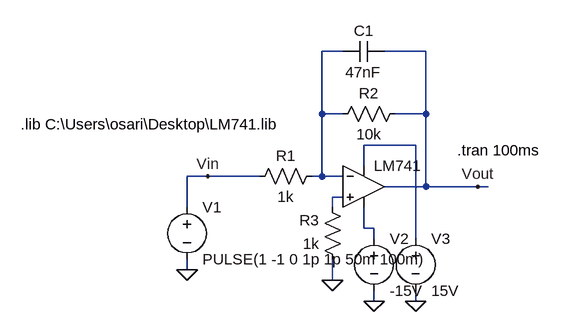
[diagram p0: schematic devre2.asc]
devre2.asc, the LTspice schematic file:
Version 4
SHEET 1 880 680
WIRE 96 0 64 0
WIRE 224 0 160 0
WIRE 64 96 64 0
WIRE 96 96 64 96
WIRE 224 96 224 0
WIRE 224 96 176 96
WIRE 208 144 128 144
WIRE 128 176 128 144
WIRE -112 192 -144 192
WIRE -32 192 -112 192
WIRE 64 192 64 96
WIRE 64 192 48 192
WIRE 96 192 64 192
WIRE 224 208 224 96
WIRE 224 208 160 208
WIRE 304 208 224 208
WIRE 320 208 304 208
WIRE 96 224 80 224
WIRE -144 240 -144 192
WIRE 80 240 80 224
WIRE 128 272 128 240
WIRE 144 272 128 272
WIRE 144 288 144 272
WIRE 208 288 208 144
WIRE -144 336 -144 320
WIRE 80 352 80 320
WIRE 144 384 144 368
WIRE 208 384 208 368
FLAG 144 384 0
FLAG 208 384 0
FLAG 304 208 Vout
FLAG -144 336 0
FLAG 80 352 0
FLAG -112 192 Vin
SYMBOL voltage -144 224 R0
WINDOW 123 0 0 Left 0
WINDOW 39 0 0 Left 0
SYMATTR InstName V1
SYMATTR Value PULSE(1 -1 0 1p 1p 50m 100m)
SYMBOL res 64 176 R90
WINDOW 0 0 56 VBottom 2
WINDOW 3 32 56 VTop 2
SYMATTR InstName R1
SYMATTR Value 1k
SYMBOL res 192 80 R90
WINDOW 0 0 56 VBottom 2
WINDOW 3 32 56 VTop 2
SYMATTR InstName R2
SYMATTR Value 10k
SYMBOL voltage 144 272 R0
WINDOW 123 0 0 Left 0
WINDOW 39 0 0 Left 0
SYMATTR InstName V2
SYMATTR Value -15V
SYMBOL voltage 208 272 R0
WINDOW 123 0 0 Left 0
WINDOW 39 0 0 Left 0
SYMATTR InstName V3
SYMATTR Value 15V
SYMBOL OpAmps\\UniversalOpamp2 128 208 R0
SYMATTR InstName LM741
SYMBOL res 96 336 R180
WINDOW 0 36 76 Left 2
WINDOW 3 36 40 Left 2
SYMATTR InstName R3
SYMATTR Value 1k
SYMBOL cap 160 -16 R90
WINDOW 0 0 32 VBottom 2
WINDOW 3 32 32 VTop 2
SYMATTR InstName C1
SYMATTR Value 47nF
TEXT -400 112 Left 2 !.lib C:\\Users\\osari\\Desktop\\LM741.lib
TEXT 272 152 Left 2 !.tran 100ms

The netlist it stands for:
* devre2.asc
V1 Vin 0 PULSE(1 -1 0 1p 1p 50m 100m)
R1 N001 Vin 1k
R2 Vout N001 10k
V2 N004 0 -15V
V3 N002 0 15V
XLM741 N003 N001 N002 N004 Vout level.2 Avol=1Meg GBW=10Meg Slew=10Meg ilimit=25m rail=0 Vos=0 phimargin=45 en=0 enk=0 in=0 ink=0 Rin=500Meg  ; pins IN+ IN- V+ V- OUT
R3 0 N003 1k
C1 Vout N001 47nF
.lib C:\Users\osari\Desktop\LM741.lib
.tran 100ms
.lib UniversalOpamps2.sub
.backanno
.end